# Altium schematic sheet outputRelay.SchDoc
size A; DocumentNumber: 3; SheetNumber: 3; SheetTotal: 4
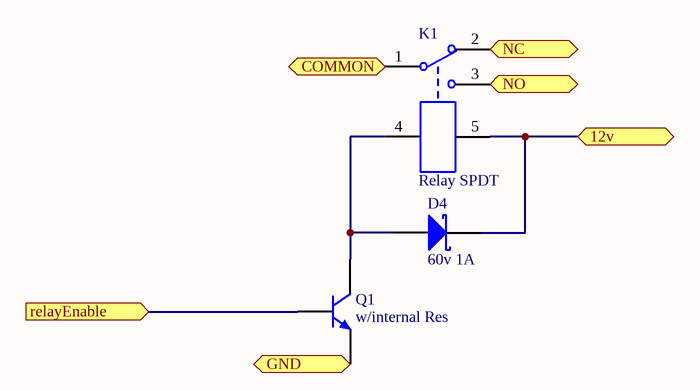
[diagram p0: outputRelay.SchDoc]

## Parts
D4  60v 1A  [SOD323]
K1  Relay SPDT  [RELAY-G5LA-1]
Q1  w/internal Res  [SOT-323-NPN]

## Ports
12v, COMMON, GND, NC, NO, relayEnable (in)

## Nets
12v: D4.2 K1.5 ; port 12v
COMMON: K1.1 ; port COMMON
GND: Q1.E ; port GND
NC: K1.2 ; port NC
NO: K1.3 ; port NO
relayEnable: Q1.B ; port relayEnable
NetD4_1: D4.1 K1.4 Q1.C

## Library data of the parts
D4 = PMEG6010CEJ: LatestRevision Note: Initial Release; Part Number: PMEG6010CEJ; Voltage: 60V; Current: 1A; Type: Schottky; Package: SOD123F; Component Type: Standard; LatestRevision Date: 29-Sep-10 09:43:01; Author: Willem Pietersz; ROHS: Y; Supplier 1: Farnell; Supplier 2: Digi-key; Supplier Part Number 2: 568-4138-1-ND; ComponentLink2Description: Datasheet; ComponentLink2URL: http://www.nxp.com/documents/data_sheet/PMEG6010CEH_PMEG6010CEJ.pdf
K1 = G5LA-14: Relay, Single-Pole Dual-Throw Relay; Current: 10; Voltage: 12; Published: 24-Mar-1999; LatestRevisionDate: 17-Jul-2002; LatestRevisionNote: Re-released for DXP Platform.; PackageReference: MODULE5B; Publisher: Altium Limited; Part Number: G5LA-14; Type: SPDT; Component Type: Relay; LatestRevision Date: 04-Oct-10; Author: Willem Pietersz; Supplier 1: Farnell; Supplier Part Number 1: 1455510; ComponentLink2Description: Datasheet; ComponentLink2URL: http://www.farnell.com/datasheets/96357.pdf
Q1 = PDTC124TU: Transistor; Current: 0.1; Voltage: 50; Part Number: PDTC124TU; Type: NPN; Supplier 1: Farnell; Supplier Part Number 1: 8737193; ComponentLink2Description: Datasheet; ComponentLink2URL: http://www.nxp.com/documents/data_sheet/PDTC124T_SERIES.pdf